# EAGLE design cee (EAGLE 6.4)
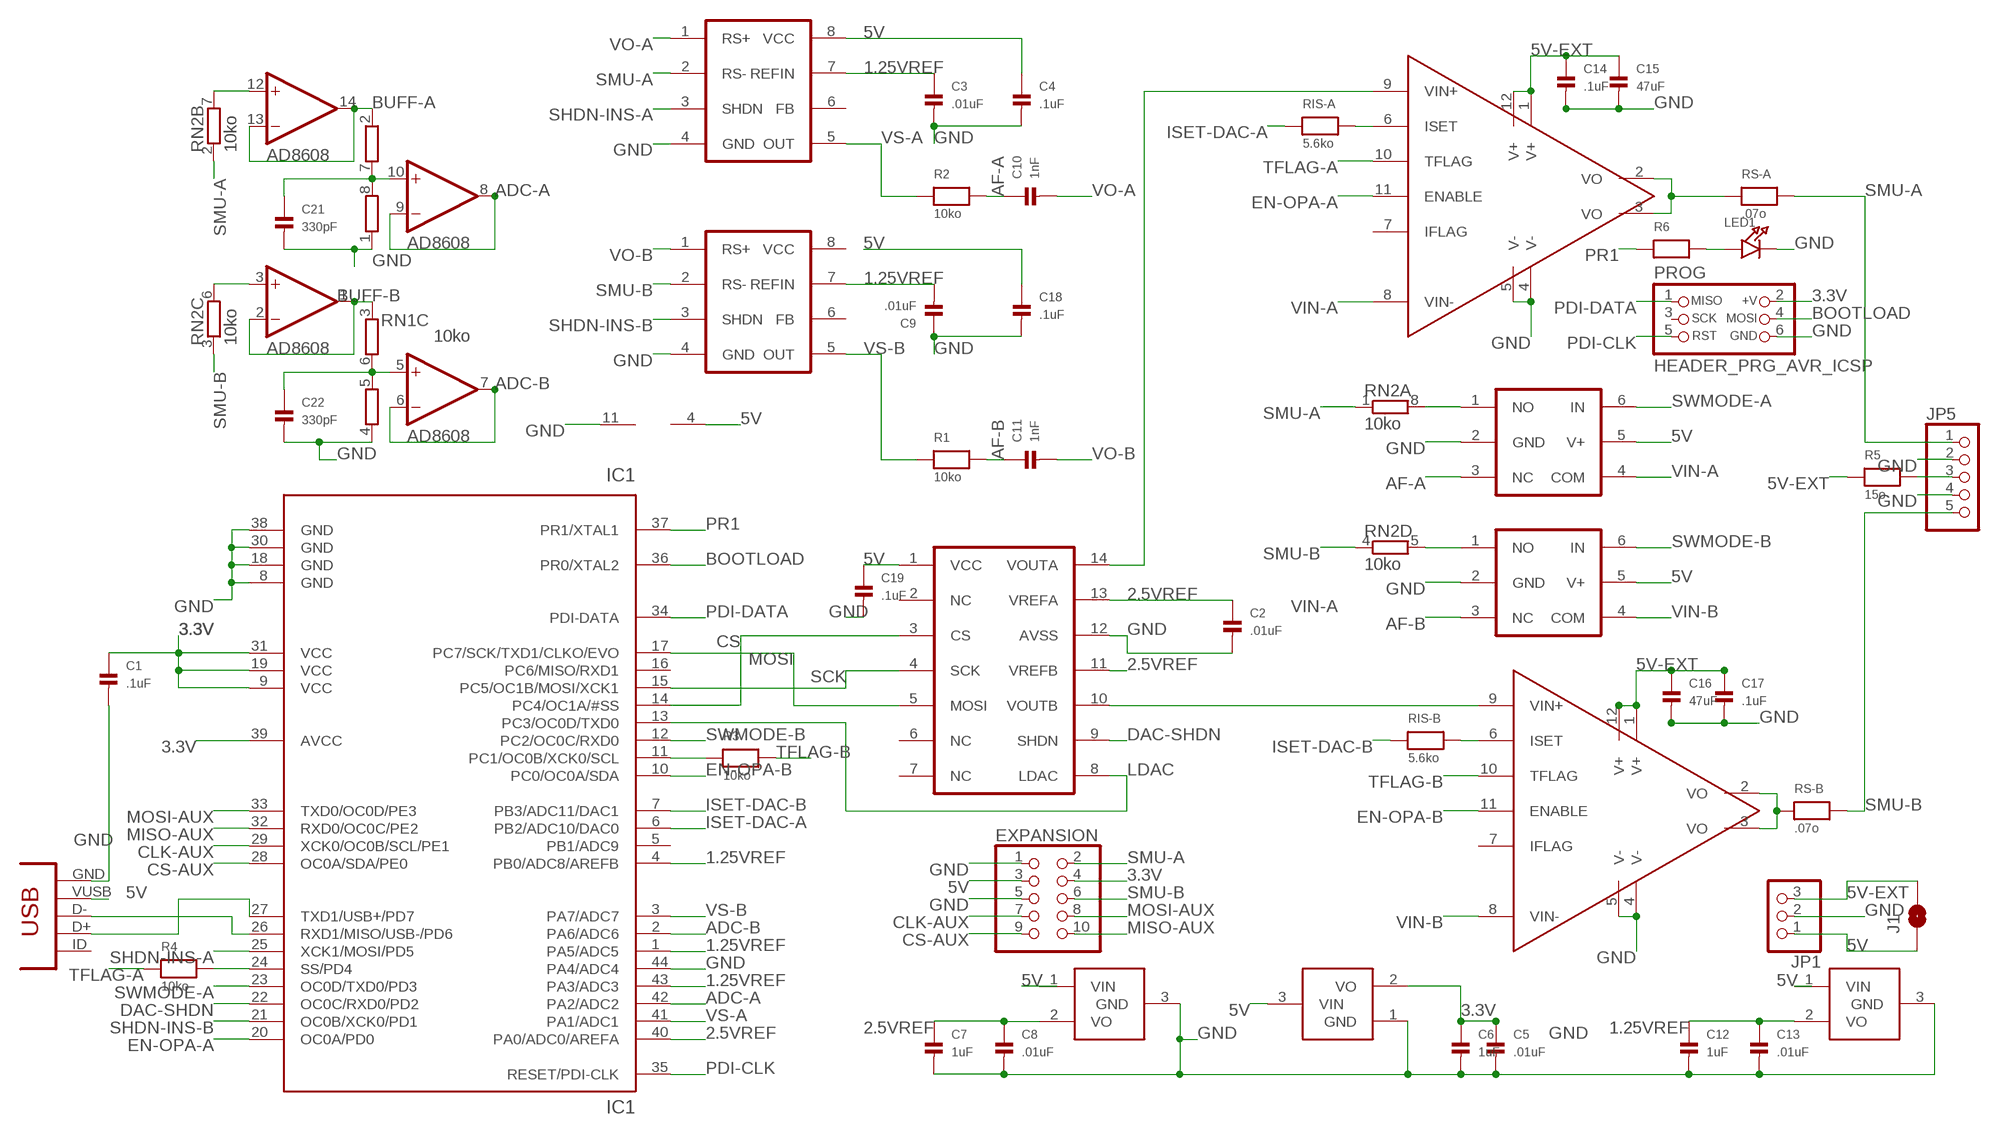
[diagram p0: schematic, sheet 1]

## Parts
1.25REF  VREF  [SOT23-3]
2.5REF  VREF  [SOT23-3]
3.3VREG  VREG  [SOT23-3]
C1  .1uF  CAP_CERAMIC0603  [0603]
C2  .01uF  CAP_CERAMIC0603  [0603]
C3  .01uF  CAP_CERAMIC0603  [0603]
C4  .1uF  CAP_CERAMIC0603  [0603]
C5  .01uF  CAP_CERAMIC0603  [0603]
C6  1uF  CAP_CERAMIC0603  [0603]
C7  1uF  CAP_CERAMIC0603  [0603]
C8  .01uF  CAP_CERAMIC0603  [0603]
C9  .01uF  CAP_CERAMIC0603  [0603]
C10  1nF  CAP_CERAMIC0603  [0603]
C11  1nF  CAP_CERAMIC0603  [0603]
C12  1uF  CAP_CERAMIC0603  [0603]
C13  .01uF  CAP_CERAMIC0603  [0603]
C14  .1uF  CAP_CERAMIC0603  [0603]
C15  47uF  CAP_CERAMIC1206  [1206]
C16  47uF  CAP_CERAMIC1206  [1206]
C17  .1uF  CAP_CERAMIC0603  [0603]
C18  .1uF  CAP_CERAMIC0603  [0603]
C19  .1uF  CAP_CERAMIC0603  [0603]
C21  330pF  CAP_CERAMIC0603  [0603]
C22  330pF  CAP_CERAMIC0603  [0603]
CS-A  MAX9919  [SO-08]
CS-B  MAX9919  [SO-08]
DAC  MCP4922  MCP4922SOIC  [SO-14]
EXPANSION  HEADER-2X5  [2X05]
IC1  IC1  ATXMEGAXXA4U  [TQFP-44]
J1  SOLDERJUMPERNC2  [SJ_2S-NOTRACE]
JP1  HEADER-1X3ROUND  [1X03_ROUND]
JP5  HEADER-1X5ROUND  [1X05_ROUND]
LED1  LED0603  [CHIPLED_0603]
OPA-A  OPA567  [QFN-12]
OPA-B  OPA567  [QFN-12]
OPA-C  AD8608  AD8608R  [SO-14]
PROG  HEADER_PRG_AVR_ICSP  [HEADER_PRG_2X03]
R1  10ko  RESISTOR0603  [0603]
R2  10ko  RESISTOR0603  [0603]
R3  10ko  RESISTOR0603  [0603]
R4  10ko  RESISTOR0603  [0603]
R5  15o  RESISTOR1206  [1206]
R6  RESISTOR0603  [0603]
RIS-A  5.6ko  RESISTOR0603  [0603]
RIS-B  5.6ko  RESISTOR0603  [0603]
RN1  10ko  RNETWORK  [RN8P-4R-CRA06S]
RN2  10ko  RNETWORK  [RN8P-4R-CRA06S]
RS-A  .07o  RESISTOR1206  [1206]
RS-B  .07o  RESISTOR1206  [1206]
SW-A  TS5A3157  [SOT23-6]
SW-B  TS5A3157  [SOT23-6]
USB1  CON-USB-MINI-BUSB1  [CONN_USB_MINI-B]

## Nets
1.25VREF: 1.25REF.2(VO) C3.1 C9.2 C12.1 C13.1 CS-A.7(REFIN) CS-B.7(REFIN) IC1.1(PA5/ADC5) IC1.4(PB0/ADC8/AREFB) IC1.43(PA3/ADC3)
2.5VREF: 2.5REF.2(VO) C2.1 C7.1 C8.1 DAC.11(VREFB) DAC.13(VREFA) IC1.40(PA0/ADC0/AREFA)
3.3V: 3.3VREG.2(VO) C1.1 C5.1 C6.1 EXPANSION.4 IC1.9(VCC) IC1.19(VCC) IC1.31(VCC) IC1.39(AVCC) PROG.2(+V)
5V: 1.25REF.1(VIN) 2.5REF.1(VIN) 3.3VREG.3(VIN) C4.1 C18.1 C19.1 CS-A.8(VCC) CS-B.8(VCC) DAC.1(VCC) EXPANSION.3 J1.1 JP1.1 OPA-C.4(V+) SW-A.5(V+) SW-B.5(V+) USB1.VUSB
5V-EXT: C14.1 C15.1 C16.1 C17.1 J1.2 JP1.3 OPA-A.1(V+) OPA-A.12(V+) OPA-B.1(V+) OPA-B.12(V+) R5.1
5V-EXT-P: JP5.3 R5.2
ADC-A: IC1.42(PA2/ADC2) OPA-C.8(C:OUT) OPA-C.9(C:-IN)
ADC-B: IC1.2(PA6/ADC6) OPA-C.6(B:-IN) OPA-C.7(B:OUT)
AF-A: C10.1 R2.2 SW-A.3(NC)
AF-B: C11.1 R1.2 SW-B.3(NC)
BOOTLOAD: IC1.36(PR0/XTAL2) PROG.4(MOSI)
BUFF-A: OPA-C.13(D:-IN) OPA-C.14(D:OUT) RN1.2
BUFF-B: OPA-C.1(A:OUT) OPA-C.2(A:-IN) RN1.3
CLK-AUX: EXPANSION.7 IC1.29(XCK0/OC0B/SCL/PE1)
CS: DAC.3(CS) IC1.14(PC4/OC1A/#SS)
CS-AUX: EXPANSION.9 IC1.28(OC0A/SDA/PE0)
D+: IC1.27(TXD1/USB+/PD7) USB1.D+
D-: IC1.26(RXD1/MISO/USB-/PD6) USB1.D-
DAC-SHDN: DAC.9(SHDN) IC1.22(OC0C/RXD0/PD2)
EN-OPA-A: IC1.20(OC0A/PD0) OPA-A.11(ENABLE)
EN-OPA-B: IC1.10(PC0/OC0A/SDA) OPA-B.11(ENABLE)
GND: 1.25REF.3(GND) 2.5REF.3(GND) 3.3VREG.1(GND) C1.2 C2.2 C3.2 C4.2 C5.2 C6.2 C7.2 C8.2 C9.1 C12.2 C13.2 C14.2 C15.2 C16.2 C17.2 C18.2 C19.2 C21.2 C22.2 CS-A.4(GND) CS-B.4(GND) DAC.12(AVSS) EXPANSION.1 EXPANSION.5 IC1.8(GND) IC1.18(GND) IC1.30(GND) IC1.38(GND) IC1.44(PA4/ADC4) JP1.2 JP5.2 JP5.4 LED1.C OPA-A.4(V-) OPA-A.5(V-) OPA-B.4(V-) OPA-B.5(V-) OPA-C.11(V-) PROG.6(GND) RN1.1 RN1.4 SW-A.2(GND) SW-B.2(GND) USB1.GND
ISET-A: OPA-A.6(ISET) RIS-A.2
ISET-B: OPA-B.6(ISET) RIS-B.2
ISET-DAC-A: IC1.6(PB2/ADC10/DAC0) RIS-A.1
ISET-DAC-B: IC1.7(PB3/ADC11/DAC1) RIS-B.1
LDAC: DAC.8(LDAC) IC1.13(PC3/OC0D/TXD0)
LEDR: LED1.A R6.2
MISO-AUX: EXPANSION.10 IC1.32(RXD0/OC0C/PE2)
MOSI: DAC.5(MOSI) IC1.17(PC7/SCK/TXD1/CLKO/EVO)
MOSI-AUX: EXPANSION.8 IC1.33(TXD0/OC0D/PE3)
N$1: C21.1 OPA-C.10(C:+IN) RN1.7 RN1.8
N$2: C22.1 OPA-C.5(B:+IN) RN1.5 RN1.6
PDI-CLK: IC1.35(RESET/PDI-CLK) PROG.5(RST)
PDI-DATA: IC1.34(PDI-DATA) PROG.1(MISO)
PR1: IC1.37(PR1/XTAL1) R6.1
SCK: DAC.4(SCK) IC1.15(PC5/OC1B/MOSI/XCK1)
SHDN-INS-A: CS-A.3(SHDN) IC1.25(XCK1/MOSI/PD5)
SHDN-INS-B: CS-B.3(SHDN) IC1.21(OC0B/XCK0/PD1)
SMU-A: CS-A.2(RS-) EXPANSION.2 JP5.1 RN2.1 RN2.2 RS-A.2
SMU-B: CS-B.2(RS-) EXPANSION.6 JP5.5 RN2.3 RN2.4 RS-B.2
SMUP-A: OPA-C.12(D:+IN) RN2.7
SMUP-B: OPA-C.3(A:+IN) RN2.6
SMUP-SW-A: RN2.8 SW-A.1(NO)
SMUP-SW-B: RN2.5 SW-B.1(NO)
SWMODE-A: IC1.23(OC0D/TXD0/PD3) SW-A.6(IN)
SWMODE-B: IC1.12(PC2/OC0C/RXD0) SW-B.6(IN)
TFLAG-A: OPA-A.10(TFLAG) R4.1
TFLAG-B: OPA-B.10(TFLAG) R3.2
TFLAGP-A: IC1.24(SS/PD4) R4.2
TFLAGP-B: IC1.11(PC1/OC0B/XCK0/SCL) R3.1
VIN-A: OPA-A.8(VIN-) SW-A.4(COM)
VIN-B: OPA-B.8(VIN-) SW-B.4(COM)
VO-A: C10.2 CS-A.1(RS+) OPA-A.2(VO) OPA-A.3(VO) RS-A.1
VO-B: C11.2 CS-B.1(RS+) OPA-B.2(VO) OPA-B.3(VO) RS-B.1
VOUT-A: DAC.14(VOUTA) OPA-A.9(VIN+)
VOUT-B: DAC.10(VOUTB) OPA-B.9(VIN+)
VS-A: CS-A.5(OUT) IC1.41(PA1/ADC1) R2.1
VS-B: CS-B.5(OUT) IC1.3(PA7/ADC7) R1.1
Unconnected: CS-A.6(FB) CS-B.6(FB) DAC.2(NC) DAC.6(NC) DAC.7(NC) IC1.5(PB1/ADC9) IC1.16(PC6/MISO/RXD1) OPA-A.7(IFLAG) OPA-B.7(IFLAG) PROG.3(SCK) USB1.BODY@1(BODY) USB1.BODY@2(BODY) USB1.BODY@3(BODY) USB1.BODY@4(BODY) USB1.ID(USBID)

## Library data of the parts
1.25REF 2.5REF = nonolith:VREF
3.3VREG = nonolith:VREG
C1-C19 C21 C22 = nonolith:CAP_CERAMIC: Ceramic Capacitors 0402 - 0402 Surface Mount Capacitors 0.1uF 10V 10% [Digikey: 490-1318-2-ND] 0603 - 0603 Surface Mount Capacitors 16 pF 50V 5% [Digikey: 445-5051-2-ND] 22 pF 50V [Digikey: PCC220ACVTR-ND] 33 pF 50V 5% [Digikey: 490-1415-1-ND] 56pF 50V 5% [Digikey: 490-1421-1-ND] 220pF 50V 5% [Digikey: 445-1285-1-ND] 680 pF 50V 2200 pF 50V 5% C0G [Digikey: 445-1297-1-ND] 5600 pF 100V 5% X7R [Digikey: 478-3711-1-ND] 0.1 µF 25V 10% [Digikey: PCC2277TR-ND] 0.22 µF 16V 10% X7R [Digikey: 445-1318-1-ND] 1.0 µF 25V 10% [Digikey: 445-5146-2-ND] 0603 - RF Specific 3pF 250V +/-0.1pF RF [Digikey: 712-1347-1-ND] 18 pF 250V 5% [Digikey: 478-3505-1-ND or 712-1322-1-ND] 56 pF 250V 5% C0G RF [Digikey: 490-4867-1-ND] 68 pF 250V RF [Digikey: 490-4868-1-ND] 0805 - 0805 Surface Mount Capacitors 220 pF 250V 2% RF Ceramic Capacitor [Digikey: 712-1398-1-ND] 1000 pF 50V 2% NP0 Ceramic Capacitor [Digikey: 478-3760-1-ND] 0.1 µF 25V 10% Ceramic Capacitor [Digikey: PCC1828TR-ND] 1.0 µF 16V 10% Ceramic Capacitor[Digikey: 490-1691-2-ND] 10.0 µF 10V 10% Ceramic Capacitor[Digikey: 709-1228-1-ND] 1206 - 1206 Surface Mount Capacitors
CS-A CS-B = nonolith:MAX9919: MAX9919 single-channel current sense amp with high common mode voltage range and high bandwidth
DAC = nonolith:MCP4922: MCP4922 12b SPI DAC
EXPANSION = nonolith:HEADER-2X5: PIN HEADER
IC1 = nonolith:ATXMEGAXXA4U: ATXMEGA A4U Series (XMEGA+USB)
J1 = SparkFun:SOLDERJUMPER: Solder Jumper Standard SMD solder jumper. Used to automate production. Two varients : Normally Open and Normally Closed are the same, but have different paste layers. NC will have a large amount of paste and should jumper during reflow.
JP1 = nonolith:HEADER-1X3: PIN HEADER
JP5 = nonolith:HEADER-1X5: PIN HEADER
LED1 = microbuilder:LED: LED 0603 - 0603 Surface Mount Package 2mA: Green LED - Low Power (3.9mcd, 2ma, 1.7Vf) - Digikey: 475-2709-2-ND Orange LED - Low Power (9.8mcd, 2ma, 1.8Vf) - Digikey: 475-1194-2-ND Red LED - Low Power (5mcd, 2ma, 1.8Vf) - Digikey: 475-1195-2-ND Yellow LED - Low Power (7mcd, 2ma, 1.8Vf) - Digikey: 475-1196-2-ND 5mA: Blue LED - Low Power (17mcd, 5ma, 2.9Vf) - Digikey: LNJ937W8CRACT-ND 0805 - 0805 Surface Mount Package 2mA: Red LED (8.8mcd, 2mA, 1.8Vf, Clear) - Low Power [Digikey: 475-2510-1-ND] Green LED (5mcd, 2mA, 1.8Vf, Clear) - Low Power [Digikey: 475-2730-1-ND] Yellow LED (11.3mcd, 2mA, 1.8Vf, Clear) - Low Power [Digikey: 475-2555-1-ND] 20mA: Red LED (104mcd, 20mA, Diffused) - LS R976 [Digikey: 475-1278-6-ND] Red LED (12mcd, 20mA, 2.0Vf, Clear) - APT2012EC [Digikey: 754-1128-1-ND] Green LED (15mcd, 20mA, 2.2Vf, Clear) - APT2012GC [Digikey: 754-1131-1-ND] Orange LED (160mcd, 20mA, 2.1Vf, Clear) - APT2012SECK [Digikey: 754-1130-1-ND] 1206 - 1206 Surface Mount Package Green LED (26mcd, 20mA, Diffused) - LG N971 [Digikey: 475-1407-6-ND] Red LED (15mcd, 20mA, Diffused) - LH N974 [Digikey: 475-1416-6-ND]
OPA-A OPA-B = nonolith:OPA567: OPA567: 2a RRIO CMOS OPA / QFN12
OPA-C = nonolith:AD8608
PROG = dp_devices:HEADER_PRG_AVR_ICSP: 2x3 AVR ICSP programming header
R1-R6 RIS-A RIS-B RS-A RS-B = nonolith:RESISTOR: Resistors 0402 - 0402 Surface Mount Package 10.0K 1% 1/16W [Digikey: 311-10.0KLRTR-ND] 0603 - 0603 Surface Mount Package 0 Ohm 1/10 Watt 1% Resistor 15 Ohm 1/10 Watt 1% Resistor 33 Ohm 1/10 Watt 1% Resistor 49.9 Ohm 1/10 Watt 1% Resistor 100 Ohm 1/10 Watt 1% Resistor 150 Ohm 1/10 Watt 1% Resistor 240 Ohm 1/10 Watt 1% Resistor 390 Ohm 1/10 Watt 1% Resistor 560 Ohm 1/10 Watt 1% Resistor 750 Ohm 1/10 Watt 1% Resistor 1.0K Ohm 1/10 Watt 1% Resistor 1.5K Ohm 1/10 Watt 1% Resistor 2.0K Ohm 1/10 Watt 1% Resistor 4.7K Ohm 1/10 Watt 1% Resistor 10.0K Ohm 1/10 Watt 1% Resistor 20.0K Ohm 1/10 Watt 1% Resistor 33.0K Ohm 1/10 Watt 1% Resistor 100.0K Ohm 1/10 Watt 1% Resistor 0805 - 0805 Surface Mount Package 0 Ohm 1/8 Watt 1% Resistor 33 Ohm 1/8 Watt 1% Resistor 100 Ohm 1/8 Watt 1% Resistor 150 Ohm 1/8 Watt 1% Resistor 200 Ohm 1/8 Watt 1% Resistor 240 Ohm 1/8 Watt 1% Resistor 330 Ohm 1/8 Watt 1% Resistor 390 Ohm 1/8 Watt 1% Resistor 470 Ohm 1/8 Watt 1% Resistor 1.0K Ohm 1/8 Watt 1% Resistor 1.5K Ohm 1/8 Watt 1% Resistor 2.0K Ohm 1/8 Watt 1% Resistor 4.7K Ohm 1/8 Watt 1% Resistor 5.1K Ohm 1/8 Watt 1% Resistor 5.6K Ohm 1/8 Watt 1% Resistor 10.0K Ohm 1/8 Watt 1% Resistor 22.0K Ohm 1/8 Watt 1% Resistor 33.0K Ohm 1/8 Watt 1% Resistor 100K Ohm 1/8 Watt 1% Resistor 1206 - 1206 Surface Mount Package
RN1 RN2 = nonolith:RNETWORK: 4 Resistor Array 0603
SW-A SW-B = nonolith:TS5A3157: Single SPDT Switch in SOT23
USB1 = dp_devices:CON-USB-MINI-B: USB connector

## Net classes
0 default: width 0.254 mm, clearance 0.127 mm

## Board
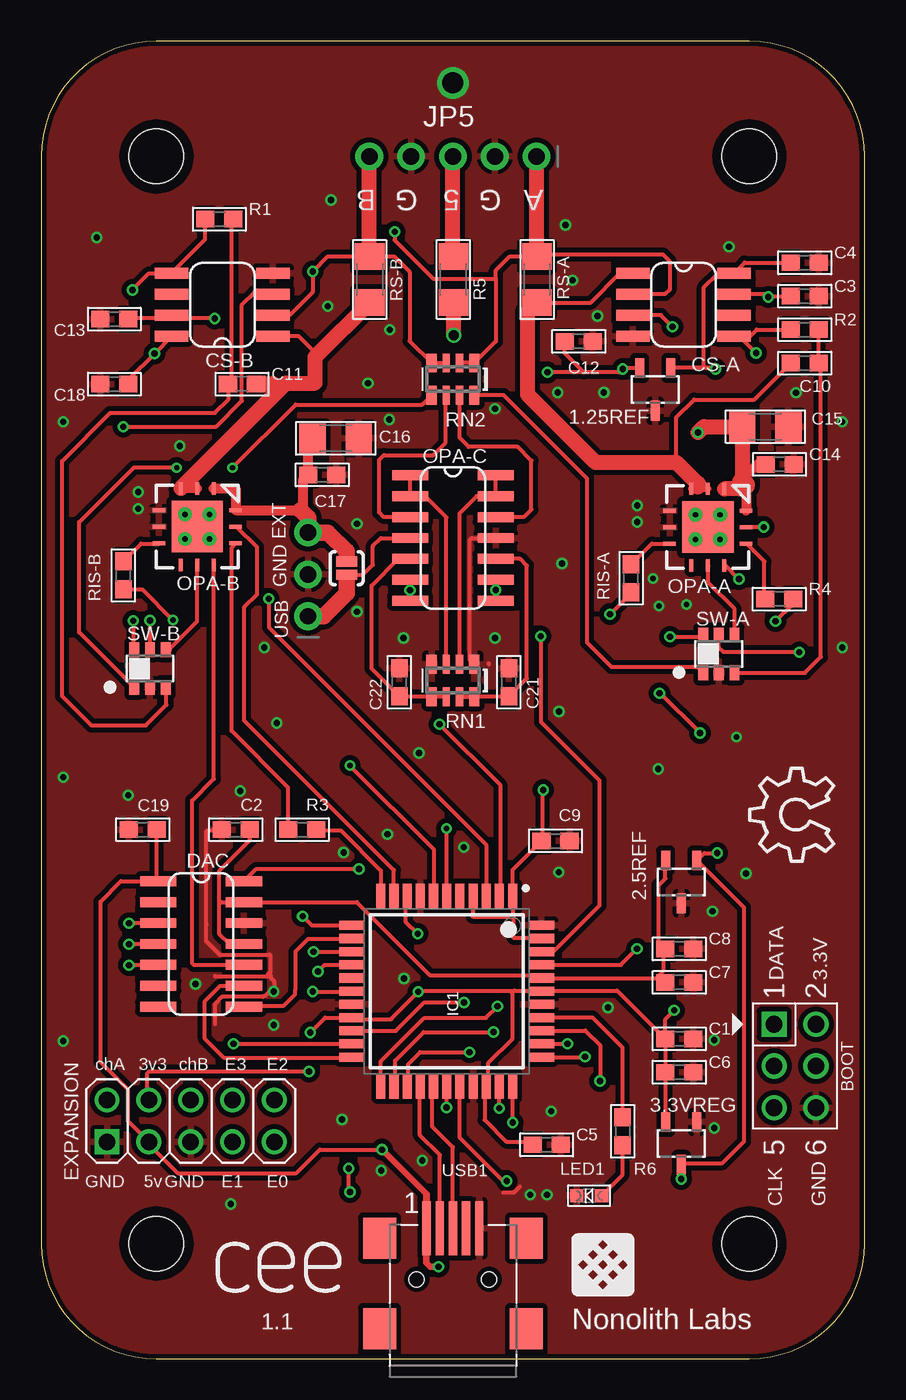
[diagram p1: board, top side]
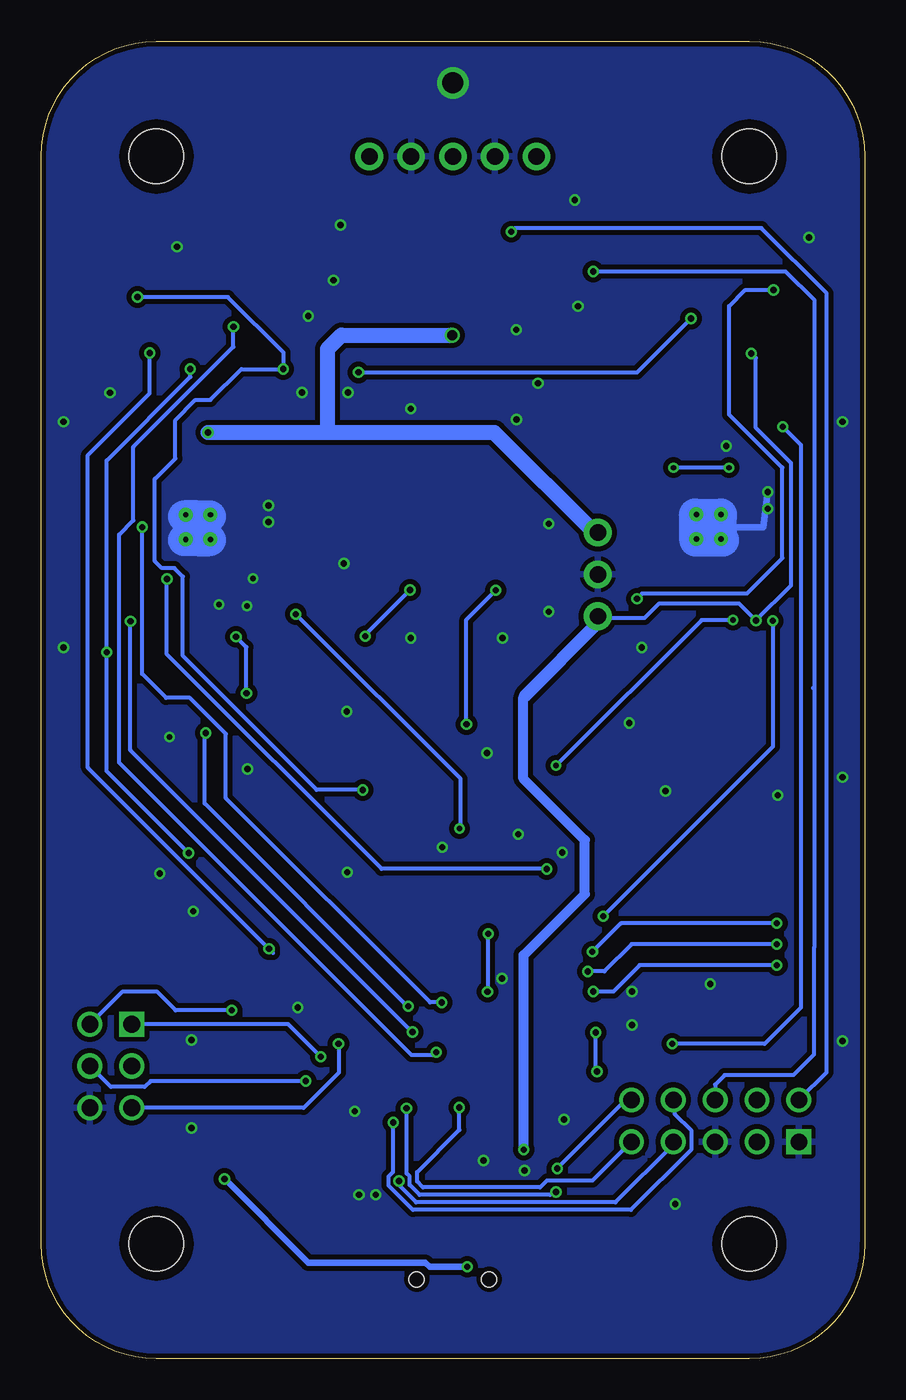
[diagram p2: board, bottom side, seen from below]

Size 50 x 80 mm. Coordinates in mm from the lower left corner, seen from the top.
Outline: 43,0 arc90 50,7 50,73 arc90 43,80 7,80 arc90 0,73 0,7 arc90 7,0 43,0
Copper layers (1*16): Top 0.035mm / dielectric 1.5mm / Bottom 0.035mm
Design rules "Fusion_eagle_rule_v1.1 *": minimum track width 6mil, minimum drill 12mil, track to track 6mil, track to pad 6mil, pad to pad 6mil, via to via 6mil, smd to smd 0mil, copper to edge 10mil, drill to drill 10mil, minimum pad ring 10mil, minimum via ring 6mil, stop-mask expansion 2mil, vias tented up to drill 100mil, thermal gap 10mil

### Footprints (pad centres in the part's own frame; a part is rotated, then mirrored left to right if it is on the bottom)
SOT23-3 = smd 0.55 x 1.2: 1 0.95,1.3; 2 -0.95,1.3; 3 0,-1.3
0603 = smd 1.1 x 1: 1 -0.85,0; 2 0.85,0
1206 = smd 1.6 x 1.8: 1 -1.4,0; 2 1.4,0
SO-08 = smd 0.66 x 2.032: 1 -1.905,-3.073; 2 -0.635,-3.073; 3 0.635,-3.073; 4 1.905,-3.073; 5 1.905,3.073; 6 0.635,3.073; 7 -0.635,3.073; 8 -1.905,3.073
SO-14 = smd 0.6 x 2.2: 1 -3.81,-2.6; 2 -2.54,-2.6; 3 -1.27,-2.6; 4 0,-2.6; 5 1.27,-2.6; 6 2.54,-2.6; 7 3.81,-2.6; 8 3.81,2.6; 9 2.54,2.6; 10 1.27,2.6; 11 0,2.6; 12 -1.27,2.6; 13 -2.54,2.6; 14 -3.81,2.6
2X05 = drill 1 square: 1 -5.08,-1.27 | drill 1: 2 -5.08,1.27; 3 -2.54,-1.27; 4 -2.54,1.27; 5 0,-1.27; 6 0,1.27; 7 2.54,-1.27; 8 2.54,1.27; 9 5.08,-1.27; 10 5.08,1.27
TQFP-44 = smd 1.55 x 0.55: 1 -5.75,4; 2 -5.75,3.2; 3 -5.75,2.4; 4 -5.75,1.6; 5 -5.75,0.8; 6 -5.75,0; 7 -5.75,-0.8; 8 -5.75,-1.6; 9 -5.75,-2.4; 10 -5.75,-3.2; 11 -5.75,-4; 23 5.75,-4; 24 5.75,-3.2; 25 5.75,-2.4; 26 5.75,-1.6; 27 5.75,-0.8; 28 5.75,0; 29 5.75,0.8; 30 5.75,1.6; 31 5.75,2.4; 32 5.75,3.2; 33 5.75,4 | smd 0.55 x 1.55: 12 -4,-5.75; 13 -3.2,-5.75; 14 -2.4,-5.75; 15 -1.6,-5.75; 16 -0.8,-5.75; 17 0,-5.75; 18 0.8,-5.75; 19 1.6,-5.75; 20 2.4,-5.75; 21 3.2,-5.75; 22 4,-5.75; 34 4,5.75; 35 3.2,5.75; 36 2.4,5.75; 37 1.6,5.75; 38 0.8,5.75; 39 0,5.75; 40 -0.8,5.75; 41 -1.6,5.75; 42 -2.4,5.75; 43 -3.2,5.75; 44 -4,5.75
SJ_2S-NOTRACE = smd 0.635 x 1.27: 1 -0.401,0; 2 0.413,0
1X03_ROUND = drill 1 pad 1.676: 1 -2.54,0; 2 0,0; 3 2.54,0
1X05_ROUND = drill 1 pad 1.676: 1 -5.08,0; 2 -2.54,0; 3 0,0; 4 2.54,0; 5 5.08,0
CHIPLED_0603 = smd 0.8 x 0.8: A 0,-0.75; C 0,0.75
QFN-12 = smd 0.75 x 0.24: 1 -2.365,0.96; 2 -2.365,-0.04; 3 -2.365,-1.04; 7 2.285,-1.04; 8 2.285,-0.04; 9 2.285,0.96 | smd 0.24 x 0.75: 4 -1.04,-2.365; 5 -0.04,-2.365; 6 0.96,-2.365; 10 0.96,2.285; 11 -0.04,2.285; 12 -1.04,2.285 | smd 3.12 x 3.12: P$1 -0.04,-0.04 | drill 0.33: P$2 -0.786,0.706; P$4 0.706,0.706; P$6 -0.786,-0.786; P$7 0.706,-0.786
HEADER_PRG_2X03 = drill 1.016 square: 1 -2.54,-1.27 | drill 1.016: 2 -2.54,1.27; 3 0,-1.27; 4 0,1.27; 5 2.54,-1.27; 6 2.54,1.27
RN8P-4R-CRA06S = smd 0.63 x 1.15: 1 -1.295,-0.975; 4 1.295,-0.975; 5 1.295,0.975; 8 -1.295,0.975 | smd 0.44 x 1.15: 2 -0.4,-0.975; 3 0.4,-0.975; 6 0.4,0.975; 7 -0.4,0.975
SOT23-6 = smd 0.6 x 0.9: 1 -0.95,-1.15; 2 0,-1.15; 3 0.95,-1.15; 4 0.95,1.15; 5 0,1.15; 6 -0.95,1.15
STAND-OFF = hole 3.302: 0,0
CONN_USB_MINI-B = smd 2 x 2.5: BODY@1 -4.45,2.5; BODY@2 4.45,2.5; BODY@3 4.45,-3; BODY@4 -4.45,-3 | smd 0.5 x 3.3: D+ 0,3.1; D- -0.8,3.1; GND 1.6,3.1; ID 0.8,3.1; VUSB -1.6,3.1 | hole 0.9: -2.2,0; 2.2,0

### Placement (x,y rotation side)
1.25REF  37.28,58.86 0 top
2.5REF  38.86,28.96 0 top
3.3VREG  38.86,13.08 0 top
C1  38.73,19.43 0 top
C2  11.81,32.13 180 top
C3  46.35,64.52 0 top
C4  46.35,66.55 0 top
C5  30.69,13 0 top
C6  38.73,17.4 0 top
C7  38.73,22.86 0 top
C8  38.73,24.89 0 top
C9  31.23,31.44 180 top
C10  46.35,60.45 180 top
C11  12.19,59.18 0 top
C12  32.63,61.78 0 top
C13  4.45,63.12 180 top
C14  44.83,54.31 0 top
C15  43.97,56.59 0 top
C16  17.88,55.88 0 top
C17  17.07,53.67 0 top
C18  4.45,59.18 180 top
C19  6.17,32.13 180 top
C21  28.4,41.07 90 top
C22  21.74,41.07 90 top
CS-A  39,64 270 top
CS-B  11,64 90 top
DAC  9.71,25.19 270 top
EXPANSION  9.08,14.45 0 top
IC1  24.62,22.32 270 top
J1  18.54,48.01 90 top
JP1  16.21,47.62 90 top
JP5  25,73 180 top
LED1  33.27,9.91 90 top
OPA-A  40.51,50.46 270 top
OPA-B  9.51,50.49 270 top
OPA-C  25,49.83 270 top
PROG  45.77,17.78 270 top
R1  10.82,69.19 0 top
R2  46.35,62.48 0 top
R3  15.85,32.13 180 top
R4  44.81,46.13 0 top
R5  25.03,65.53 90 top
R6  35.31,13.82 270 top
RIS-A  35.81,47.39 90 top
RIS-B  5,47.57 90 top
RN1  25,41.18 180 top
RN2  25,59.49 180 top
RS-A  30.11,65.53 90 top
RS-B  19.95,65.53 90 top
SW-A  41.15,42.8 0 top
SW-B  6.6,41.91 0 top
U$1  [OSHW_8X200_NOTEXT]  48.11,30.2 90 top
U$2  [LOGO_CEE]  10.49,3.61 0 top
U$3  [LOGO_NONOLITH]  32.21,3.81 0 top
U$8  [STAND-OFF]  7,7 0 top
U$9  [STAND-OFF]  43,7 0 top
U$10  [STAND-OFF]  43,73 0 top
U$11  [STAND-OFF]  7,73 0 top
USB1  25,4.83 0 top

### Tracks (layer width: path | path; a pad name or v marks a point on that pad's centre or on a via)
1.25VREF  (via drill 0.38)
  Top 0.254: CS-A.7 43.98,64.64 v44.15,64.47 44.19,64.52 C3.1 | C9.2 | 28.65,26.85 28.65,28.07 IC1.1 28.62,29.68 C9.2 | 26.22,26.85 28.65,26.85 | 26.22,26.85 26.19,26.85 | 26.22,26.85 IC1.4 | 28.65,26.85 28.65,25.6 28.7,25.55 30.34,25.55 | C9.2 30.45,31.52 30.45,34.52 v30.48,34.54 | 7.73,63.17 CS-B.7 | v10.54,63.17 7.73,63.17 | 1.25REF.2 35.37,60.16 v35.31,60.1 35.1,59.89 32.94,59.89 | 32.94,59.89 v30.73,59.89 | C12.1 31.78,61.05 32.94,59.89 | 7.73,63.17 5.35,63.17 C13.1
  Top 0.406: 30.34,25.55 30.37,25.55 IC1.43
  Bottom 0.254: v44.15,64.47 38.66,64.47 35.28,61.09 35.28,60.12 v35.31,60.1 37.85,60.1 39.73,58.22 40.64,58.22 41.86,57 41.86,54.66 43.08,53.44 43.1,53.44 43.1,48.44 42.67,48.01 41.91,48.01 41.4,47.5 41.4,42.67 33.27,34.54 v30.48,34.54 | v10.54,63.17 13.82,59.89 v30.73,59.89
2.5VREF
  Top 0.254: DAC.13 19.16,27.73 23.6,23.29 30.25,23.29 30.28,23.27 IC1.40 37.37,23.12 37.49,23.16 37.8,22.86 C7.1 37.49,23.27 37.8,23.57 37.8,24.89 C8.1 37.8,24.99 37.49,25.3 37.49,28.75 37.9,29.16 37.9,30.18 2.5REF.2 | DAC.13 12.27,27.69 | DAC.13 12.25,27.66 | DAC.11 11.41,25.19 10.82,25.78 10.82,27.61 | DAC.13 10.94,27.73 10.82,27.61 | 10.82,27.61 10.82,29.64 12.68,31.5 12.68,32.12 C2.1
3.3V  (via drill 0.38)
  Top 0.254: v22.86,25.81 22.15,26.52 22.15,27.94 IC1.9 | IC1.39 30.18,22.35 28.73,22.35 | 28.73,22.35 22.96,22.35 v22.9,22.29 21.26,20.65 21.26,20.62 18.9,20.62 18.9,20.69 IC1.19 17.24,20.72 v16.33,19.81 | C5.1 29.65,13.18 28.25,13.18 26.92,14.5 26.92,16.47 IC1.31 27.11,16.66 27.13,16.66 27.13,17.93 28.6,19.41 28.6,22.23 28.73,22.35 | EXPANSION.4 6.45,15.8 6.45,17.35 6.55,17.45 v16.26,17.45 | C1.1 37.87,18.99 | C1.1 37.89,19.44 37.89,20.62 v38.43,21.16 | 3.3VREG.2 37.9,14.43 37.9,17.37 C6.1 C1.1 | 30.4,22.35 34.96,22.35 C1.1
  Top 0.406: IC1.39 30.4,22.35
  Bottom 0.254: v22.86,25.81 22.86,22.23 v22.9,22.29 | v16.26,17.45 16.33,17.53 v16.33,19.81 | v38.43,21.16 41.83,21.16 42.95,22.28 45.09,22.28 PROG.2
5V  (via drill 0.38)
  Top 0.254: v6.6,44.83 SW-B.5 | SW-A.5 41.15,43.18 41.43,42.9 45.97,42.9 46,42.93 | C4.1 42.72,66.55 CS-A.8 42.04,65.91 41.1,65.91 40.23,65.05 40.23,60.28 40.36,60.16 | 2.5REF.1 39.83,30.18 | 40.36,60.16 40.88,60.16 v40.95,60.1 | 40.36,60.16 1.25REF.1 | v41.05,30.71 40.27,30.71 2.5REF.1 | 46,42.93 46.02,42.95 | v46.02,42.9 46,42.93 | C18.1 5.29,59.46 5.31,59.46 v6.88,61.04 CS-B.8 | v20.7,12.7 16.92,12.7 15.49,11.28 8.28,11.28 6.55,13.01 6.55,13.16 EXPANSION.3 5.28,14.43 5.28,16.33 3.61,18.01 3.61,27.76 4.84,29 DAC.1 7.02,29 C19.1 | J1.1 19.54,47.6 20.14,48.21 20.14,49.35 20.62,49.84 OPA-C.4 | 3.3VREG.3 38.97,11.89 41.35,11.89 42.67,13.21 42.67,27.4 2.5REF.1
  Top 0.305: OPA-C.4 22.07,49.84
  Top 0.406: 38.86,11.89 3.3VREG.3 v38.86,10.92 | v20.7,12.7 23.4,10 | 23.4,10 USB1.VUSB | 23.4,10 23.37,10 23.37,5.84 23.62,5.59 v24.13,5.59
  Top 0.61: 18.54,47.19 J1.1
  Top 0.762: JP1.1 16.59,45.09
  Top 1.016: 16.59,45.09 17.14,45.09 18.54,46.48 18.54,47.19
  Bottom 0.254: 20.7,40.18 20.62,40.26 | v40.95,60.1 40.95,59.61 46.02,54.53 v46.02,42.9 46.02,35.69 v41.05,30.71 | v6.88,61.04 6.6,60.76 6.6,56.52 4.47,54.38 4.47,46.97 v6.6,44.83 7.64,45.87 12.47,45.87 13.36,44.98 16.1,44.98 JP1.1
  Bottom 0.406: v24.13,5.59 26.42,5.59 26.67,5.84 33.78,5.84 v38.86,10.92
  Bottom 0.61: v20.7,12.7 20.7,24.51 16.99,28.22 16.99,31.5 20.73,35.23 20.73,40.16 20.7,40.18
  Bottom 0.762: 20.62,40.26 16.2,44.68 JP1.1
5V-EXT  (via drill 0.38, 0.6)
  Top 0.61: 16.4,55.35 C16.1 16.22,55.72 C17.1 15.9,53.35 15.9,51.52 15.75,51.52 OPA-B.12 11.8,52.85 OPA-B.1 | OPA-A.12 42.8,52.45 42.45,52.83 42.69,53.07 42.77,53.15 | C14.1 43.48,54.3 42.57,53.39 | 18.54,49.02 18.54,48.77 | 18.54,48.71 J1.2
  Top 0.914: 42.45,52.83 OPA-A.1 | v39.88,56.24 40.23,56.59 C15.1 42.57,53.39 42.57,53.19 | v25.04,62.15 25.04,64.16 R5.1
  Top 1.016: 15.75,51.52 16.2,51.07 JP1.3 17.4,50.16 18.54,49.02 | 18.54,48.77 18.54,48.71
  Top 1.27: 42.57,53.19 42.69,53.07
  Bottom 0.914: 16.31,50.06 22.48,56.24 32.69,56.24 | 32.69,56.24 v39.88,56.24 | v25.04,62.15 31.77,62.15 32.61,61.32 32.61,56.31 32.69,56.24
  Bottom 1.27: JP1.3 16.31,50.06
5V-EXT-P
  Top 0.914: R5.2 25,66.96 JP5.3
ADC-A  (via drill 0.38)
  Top 0.254: OPA-C.9 v27.6,46.69 OPA-C.8 | IC1.42 31.09,24.72 33.91,27.53 33.91,35.1 30.35,38.66 30.35,43.84 v30.33,43.87
  Bottom 0.254: v30.33,43.87 30.33,43.96 v27.6,46.69
ADC-B  (via drill 0.38)
  Top 0.254: 27.66,28.23 IC1.2 27.89,28.25 27.89,34.82 v24.18,38.53 | 22.1,47.3 OPA-C.6 v22.4,46.66 OPA-C.7
  Bottom 0.254: v24.18,38.53 24.18,44.88 v22.4,46.66
AF-A
  Top 0.254: C10.1 R2.2 | 42.16,41.55 SW-A.3 46.37,41.65 47.35,42.62 47.35,60.31 C10.1 | C10.1 47.24,60.35
AF-B
  Top 0.254: SW-B.3 7.62,40.74 | R1.2 11.58,69.19 11.58,59.44 11.38,59.23 C11.1 11.38,59.13 11.38,58.27 10.54,57.43 4.19,57.43 1.27,54.51 1.27,40.23 3.05,38.46 6.35,38.46 7.59,39.7 7.59,40.72 SW-B.3 | SW-B.3 7.57,40.74
BOOTLOAD  (via drill 0.38)
  Top 0.254: IC1.36 33.04,19.92 33.93,19.02 v33.93,16.87
  Bottom 0.254: PROG.4 45.77,16.51 43.71,16.51 43.36,16.87 36.17,16.87 36.09,16.87 v33.93,16.87
BUFF-A
  Top 0.254: OPA-C.14 OPA-C.13 26.44,52.38 25.4,51.33 RN1.2
BUFF-B
  Top 0.254: OPA-C.1 OPA-C.2 23.32,52.38 24.6,51.09 RN1.3
CLK-AUX  (via drill 0.38)
  Top 0.254: v28.27,10.79 28.25,10.85 27.99,10.85 25.43,13.41 IC1.29
  Bottom 0.254: v28.27,10.79 28.27,10.54 27.23,9.5 15.14,9.5 11.63,13.01 11.63,13.16 EXPANSION.7
CS  (via drill 0.38)
  Top 0.254: IC1.14 v16.54,24.71 | v5.33,26.44 7.1,26.44 DAC.3
  Bottom 0.254: v16.54,24.71 14.81,26.44 v5.33,26.44
CS-AUX  (via drill 0.38)
  Top 0.254: v24.61,15.27 IC1.28
  Bottom 0.254: v24.61,15.27 24.61,13.89 27.18,11.33 27.18,10.77 26.82,10.41 19.71,10.41 19.3,10.82 16.54,10.82 14.17,13.18 EXPANSION.9
D+
  Top 0.254: 23.75,16.5 23.75,14.1 25,12.85 USB1.D+
  Top 0.406: 23.75,16.5 IC1.27
D-
  Top 0.254: 22.99,16.54 22.99,13.59 24.2,12.38 24.2,8.96 24.13,8.89 24.13,8 USB1.D-
  Top 0.406: 22.99,16.54 IC1.26
DAC-SHDN
  Top 0.254: IC1.22 18.84,18.29 11.07,18.29 9.93,19.43 9.93,21.72 10.86,22.65 DAC.9
EN-OPA-A  (via drill 0.38)
  Top 0.254: v43.87,50.49 42.83,50.49 OPA-A.11 | v25.68,21.64 23.27,21.64 21.54,19.91 19.14,19.91 19.14,19.92 IC1.20
  Bottom 0.254: 43.81,50.44 v43.87,50.49 43.87,41.58 42.42,40.13 40.97,40.13 38.79,37.95 38.79,34.04 26.39,21.64 v25.68,21.64
EN-OPA-B
  Top 0.254: OPA-B.11 11.89,50.49 13.11,49.28 13.11,46.41 12.34,45.65 12.34,38.73 21.41,29.67 IC1.10
GND  (via drill 0.33, 0.38, 0.38 pad 0.41, 1.27)
  Top 0.254: 10.54,23.24 13.95,23.24 13.95,23.22 | 10.54,20.32 10.54,21.54 10.97,21.97 13.46,21.97 13.51,22.02 13.59,22.02 14.15,22.58 14.15,22.91 13.74,23.32 13.92,23.5 13.92,24.49 13.87,24.54 10.85,24.54 10.03,25.35 10.03,26.36 10.01,26.39 10.01,32.03 10.07,32.09 C2.2 | 28.07,10.08 28.7,10.08 29.08,10.46 | RN1.1 26.04,42.42 26.04,49.73 26.14,49.84 OPA-C.11 | 27.15,42.22 27.2,42.22 27.2,42.16
  Bottom 0.254: 41.33,49.71 42.01,49.71 42.17,49.57 | 40.54,49.71 40.54,51.16 | 8.74,50.42 8.36,50.42 8.19,50.5
  Bottom 0.406: 8.19,50.5 6.15,50.5 v5.89,52.63
  Bottom 1.93: 8.74,51.26 10.31,51.26 10.31,51.23 10.29,51.23 10.29,49.68 8.61,49.68 8.61,49.71 8.74,49.71 8.74,50.42 8.74,51.13 | 39.75,51.16 40.54,51.16 41.33,51.16 | 39.75,49.71 40.54,49.71 41.33,49.71
  other vias: 36.2,50.8 22.94,36.78 21.03,31.85 22.02,23.09 8.41,55.42 31.62,48.29 21.13,57.02 14.12,22.3 31.42,29.54 41.76,67.51 5.28,34.21 25.65,31.06 18.26,14.53 14.3,38.61 45.82,58.65 23.14,12.04 9.37,22.76 12.09,34.47 19.84,59.23 37.52,45.69 37.13,47.37 39.19,45.8 42.21,37.74 31.45,39.29 32.26,65.48 33.78,63.32 17.4,63.91 19.18,50.7 27.56,43.76 22,43.76 25,77.47 30.96,15.04 40.87,14.02 40.87,19.35 30.71,9.96 13.54,43.18 1.35,35.31 1.35,19.3 1.35,56.9 3.38,68.07 17.6,70.36 31.83,68.83 21.16,62.48 27.56,57.68 31.37,58.67 34.16,58.67 48.64,43.18 37.47,35.81 11.51,9.4 20.65,11.43 29.69,9.96 14.12,20.27 18.36,30.73 19.18,45.36 36.2,51.82 5.89,51.61 48.64,56.9 42.8,29.46 40.77,27.18 34.42,21.34
  pour Bottom (isolate 0.305): 0,80 50,80 50,0 0,0
  pour Top (isolate 0.305): -0.38,79.87 50,80 50,0 -0.38,-0.13
ISET-A
  Top 0.254: RIS-A.2 37.07,49.5 OPA-A.6
ISET-B
  Top 0.254: OPA-B.6 7.17,49.49 6.07,49.49 RIS-B.2
ISET-DAC-A  (via drill 0.33, 0.38)
  Top 0.254: v34.54,45.21 35.81,46.48 RIS-A.1 | IC1.6 v24.61,32.21
  Bottom 0.254: v34.54,45.21 24.54,35.2 24.54,32.28 v24.61,32.21
ISET-DAC-B  (via drill 0.33)
  Top 0.254: RIS-B.1 6.14,46.72 v8,44.86 | v18.75,36.02 23.82,30.94 IC1.7
  Bottom 0.254: v8,44.86 9.91,44.86 v18.75,36.02
LDAC
  Top 0.254: IC1.13 18.8,25.6 18.69,25.5 16.2,25.5 15.44,24.74 15.44,22.43 15.42,22.4 15.42,22.12 14.73,21.44 13.01,21.44 12.95,21.38 DAC.8
LEDR
  Top 0.254: R6.2 35.31,11.19 LED1.A
MISO-AUX  (via drill 0.38)
  Top 0.254: v27.81,15.21 IC1.32 | v18.67,11.56 18.67,10.21 v18.75,10.13
  Bottom 0.254: v27.81,15.21 27.81,11.25 27.64,11.07 27.64,10.57 27.03,9.96 19.1,9.96 18.92,10.13 v18.75,10.13 | EXPANSION.10 14.51,15.72 v18.67,11.56
MOSI  (via drill 0.38)
  Top 0.254: IC1.17 18.83,22.32 18.69,22.45 18.54,22.3 v16.48,22.3 | v5.33,23.9 7.1,23.9 DAC.5
  Bottom 0.254: v16.48,22.3 15.27,22.3 13.66,23.9 v5.33,23.9
MOSI-AUX  (via drill 0.38)
  Top 0.254: v28.63,14.35 IC1.33
  Bottom 0.254: 11.58,15.65 EXPANSION.8 11.53,15.54 11.53,14.86 10.52,13.84 10.52,12.72 14.2,9.04 27.43,9.04 28.91,10.52 28.91,11.07 28.63,11.35 v28.63,14.35
N$1
  Top 0.254: OPA-C.10 29.08,48.56 29.49,48.16 29.49,41.31 C21.1 26.31,40.22 RN1.8 RN1.7
N$2
  Top 0.254: OPA-C.5 21.69,48.56 20.07,46.94 20.07,41.9 C22.1 23.69,40.22 | 23.69,40.22 RN1.5 | 23.69,40.22 24.59,40.22 RN1.6
  Top 0.305: OPA-C.5 22.28,48.56
PDI-CLK  (via drill 0.38)
  Top 0.254: v31.95,19.13 IC1.35
  Bottom 0.254: PROG.5 34.06,15.24 31.93,17.37 31.93,19.1 v31.95,19.13
PDI-DATA  (via drill 0.38)
  Top 0.254: IC1.34 33,18.32 v33.02,18.34
  Bottom 0.254: v33.02,18.34 35,20.32 PROG.1
PR1
  Top 0.254: IC1.37 33.48,20.72 35.31,18.9 R6.1
SCK  (via drill 0.38)
  Top 0.254: 18.54,23.93 18.69,23.77 18.84,23.92 IC1.15 17.21,23.92 v16.82,23.52 | v5.33,25.17 7.1,25.17 DAC.4
  Bottom 0.254: v5.33,25.17 14.15,25.17 15.8,23.52 v16.82,23.52
SHDN-INS-A  (via drill 0.38)
  Top 0.254: v26.01,18.62 23.01,18.62 22.28,17.88 22.28,16.63 IC1.25 | CS-A.3 37.62,63.37 v38.33,62.66
  Bottom 0.254: v26.01,18.62 26.19,18.44 27.51,18.44 45.26,36.2 45.26,50.04 44.4,50.9 44.4,55.37 38.33,61.44 v38.33,62.66
SHDN-INS-B  (via drill 0.38, 0.38 pad 0.38)
  Top 0.254: CS-B.3 13.49,64.49 13.51,64.62 13.36,64.77 12.95,64.77 12.19,64.01 12.19,58.17 10.62,56.59 v4.98,56.59 | 18.8,19.2 IC1.21 v11.69,19.12 v11.68,19.13
  Bottom 0.254: v4.98,56.59 3.86,55.47 3.86,21.34 6.07,19.13 v11.68,19.13
SMU-A  (via drill 0.38)
  Top 0.254: RN2.2 RN2.1 27.61,61.78 27.61,65.58 | CS-A.2 37.86,64.64 38.15,64.92 38.15,66.65 37.74,67.06 30.23,67.06 RS-A.2 28.45,66.93 27.61,66.09 27.61,65.58 | v21.46,68.43 21.46,67.92 23.8,65.58 27.61,65.58
  Top 0.914: RS-A.2 30.08,66.93 JP5.1
  Bottom 0.254: EXPANSION.2 2.31,17.4 2.31,64.69 6.27,68.66 21.23,68.66 v21.46,68.43
SMU-B  (via drill 0.38)
  Top 0.254: CS-B.2 15.09,63.37 16.48,64.76 v16.48,66.02 17.4,66.93 RS-B.2 21.43,66.93 22.38,65.99 22.38,61.79 RN2.4 RN2.3
  Top 0.914: RS-B.2 19.92,66.93 JP5.5
  Bottom 0.254: 3.05,40.74 3.05,24.99 3.07,24.97 3.07,18.49 4.34,17.22 8.51,17.22 9.08,16.65 EXPANSION.6 | 3.05,40.74 3.05,64.26 4.8,66.02 v16.48,66.02 | 3.05,40.74 3.15,40.74
SMUP-A
  Top 0.254: RN2.7 25.4,55.93 25.96,55.37 28.93,55.37 29.77,54.53 29.77,51.56 29.34,51.13 27.62,51.13 OPA-C.12
SMUP-B
  Top 0.254: OPA-C.3 20.8,51.1 20.52,51.38 20.52,54.59 20.8,54.86 23.8,54.86 24.56,55.63 24.56,58.47 RN2.6
SMUP-SW-A
  Top 0.254: 39.86,41.99 SW-A.1 39.84,42.01 34.62,42.01 33.15,43.48 33.15,53.44 28.08,58.51 RN2.8
SMUP-SW-B  (via drill 0.33)
  Top 0.254: v8.23,54.1 8.2,54.13 5.64,54.13 2.31,50.8 2.31,44.1 SW-B.1 | RN2.5 23.13,57.94 15.44,57.94 v11.61,54.1
  Bottom 0.254: v8.23,54.1 v11.61,54.1
SWMODE-A  (via drill 0.38)
  Top 0.254: 27.74,21.39 v27.71,21.41 27,20.7 23.27,20.7 20.62,18.05 IC1.23 | v38.18,43.84 40.09,43.84 SW-A.6 | v37.54,40.41 37.59,40.41 v40.01,38
  Bottom 0.254: v27.71,21.41 27.76,21.41 40.08,33.73 40.08,37.92 v40.01,38 | v37.54,40.41 37.54,43.2 v38.18,43.84
SWMODE-B  (via drill 0.38)
  Top 0.254: v5.59,44.81 5.59,42.98 SW-B.6 | v15.88,26.87 16.43,26.32 IC1.12
  Bottom 0.254: v5.59,44.81 5.56,44.78 5.56,37.19 10.52,32.23 10.85,31.9 v15.88,26.87
TFLAG-A
  Top 0.254: OPA-A.10 42.85,49.48 43.91,48.42 43.91,46.18 R4.1
TFLAG-B
  Top 0.254: 11.94,49.51 11.84,49.51 OPA-B.10 11.56,49.23 11.56,38.12 15,34.68 R3.2
TFLAGP-A  (via drill 0.38)
  Top 0.254: v27.46,19.84 23.22,19.84 21.49,18.11 21.49,16.64 IC1.24 | R4.2 45.66,45.86 v44.58,44.78
  Bottom 0.254: v44.58,44.78 44.58,36.96 v27.46,19.84
TFLAGP-B
  Top 0.254: IC1.11 20.62,29.64 18.19,32.08 17.5,32.08 16.75,32.08 R3.1
VIN-A
  Top 0.254: OPA-A.8 40.51,48.13 40.51,47.12 42.1,45.53 SW-A.4
VIN-B
  Top 0.254: 7.75,43.06 9.47,44.78 OPA-B.8
  Top 0.406: SW-B.4 7.75,43.06
VO-A
  Top 0.254: CS-A.1 35.13,65.91 33.35,64.13 RS-A.1 | C10.2 43.3,58.24 39.65,58.24 38.57,57.16 38.57,54.43 | 39.87,52.97 39.62,52.97 OPA-A.3
  Top 0.406: CS-A.1 35.92,65.91 | OPA-A.3 39.51,52.83 40.49,52.83 OPA-A.2
  Top 0.914: 39.87,53.13 38.83,54.17 38.57,54.43 33.66,54.43 29.54,58.55 29.54,63.57 RS-A.1
  Top 1.016: 39.87,53.13 39.87,52.97
VO-B
  Top 0.254: CS-B.1 15.63,62.09 16.77,60.95
  Top 0.61: OPA-B.2 OPA-B.3
  Top 0.914: OPA-B.3 14.46,58.84 | 14.46,58.84 14.86,59.23 16.63,59.23 16.63,60.82 16.77,60.95 RS-B.1 | 14.12,59.18 C11.2 | 14.46,58.84 14.12,59.18 | 14.12,59.18 14.07,59.23
VOUT-A  (via drill 0.38)
  Top 0.254: v42.37,47.35 41.55,48.16 OPA-A.9 | DAC.14 13.06,29.74 v19.3,29.74
  Bottom 0.254: v42.37,47.35 42.37,42.77 29.34,29.74 v19.3,29.74
VOUT-B
  Top 0.254: 10.46,48.28 OPA-B.9 10.49,48.19 10.49,35.2 9.17,33.88 9.17,24.03 9.28,23.92 DAC.10 12.3,23.9
VS-A  (via drill 0.38)
  Top 0.254: 45.72,62.48 R2.1 43.43,62.48 42.71,61.76 | CS-A.5 42.38,62.09 42.71,61.76 | v43.41,61.06 42.71,61.76 | IC1.41 35.2,23.92 v36.17,24.89
  Bottom 0.254: v43.41,61.06 43.41,58.62 47.17,54.86 47.17,35.89 v36.17,24.89 35.92,24.64
VS-B  (via drill 0.38)
  Top 0.254: CS-B.5 7.92,65.84 | IC1.3 27.02,31.22 13.82,44.42 v13.82,46.15 | R1.1 9.96,69.19 9.96,67.97 7.92,65.94 CS-B.5 | v5.54,64.9 6.54,65.91 CS-B.5
  Bottom 0.254: v13.82,46.15 13.51,46.46 7.16,46.46 5,48.62 5,54.1 8.23,57.33 8.23,63.91 7.24,64.9 v5.54,64.9

### Text on the board
tPlace: EXT | GND | USB
tNames: B | G | 5 | G | A | OPA-B | OPA-A | DATA | 3.3V | chA | 3v3 | chB | E3 | E2 | BOOT | EXPANSION | GND | 5v | GND | E1 | E0 | CLK | GND | 1.1 | Nonolith Labs